# EAGLE design MainBoard (EAGLE 9.6.2)
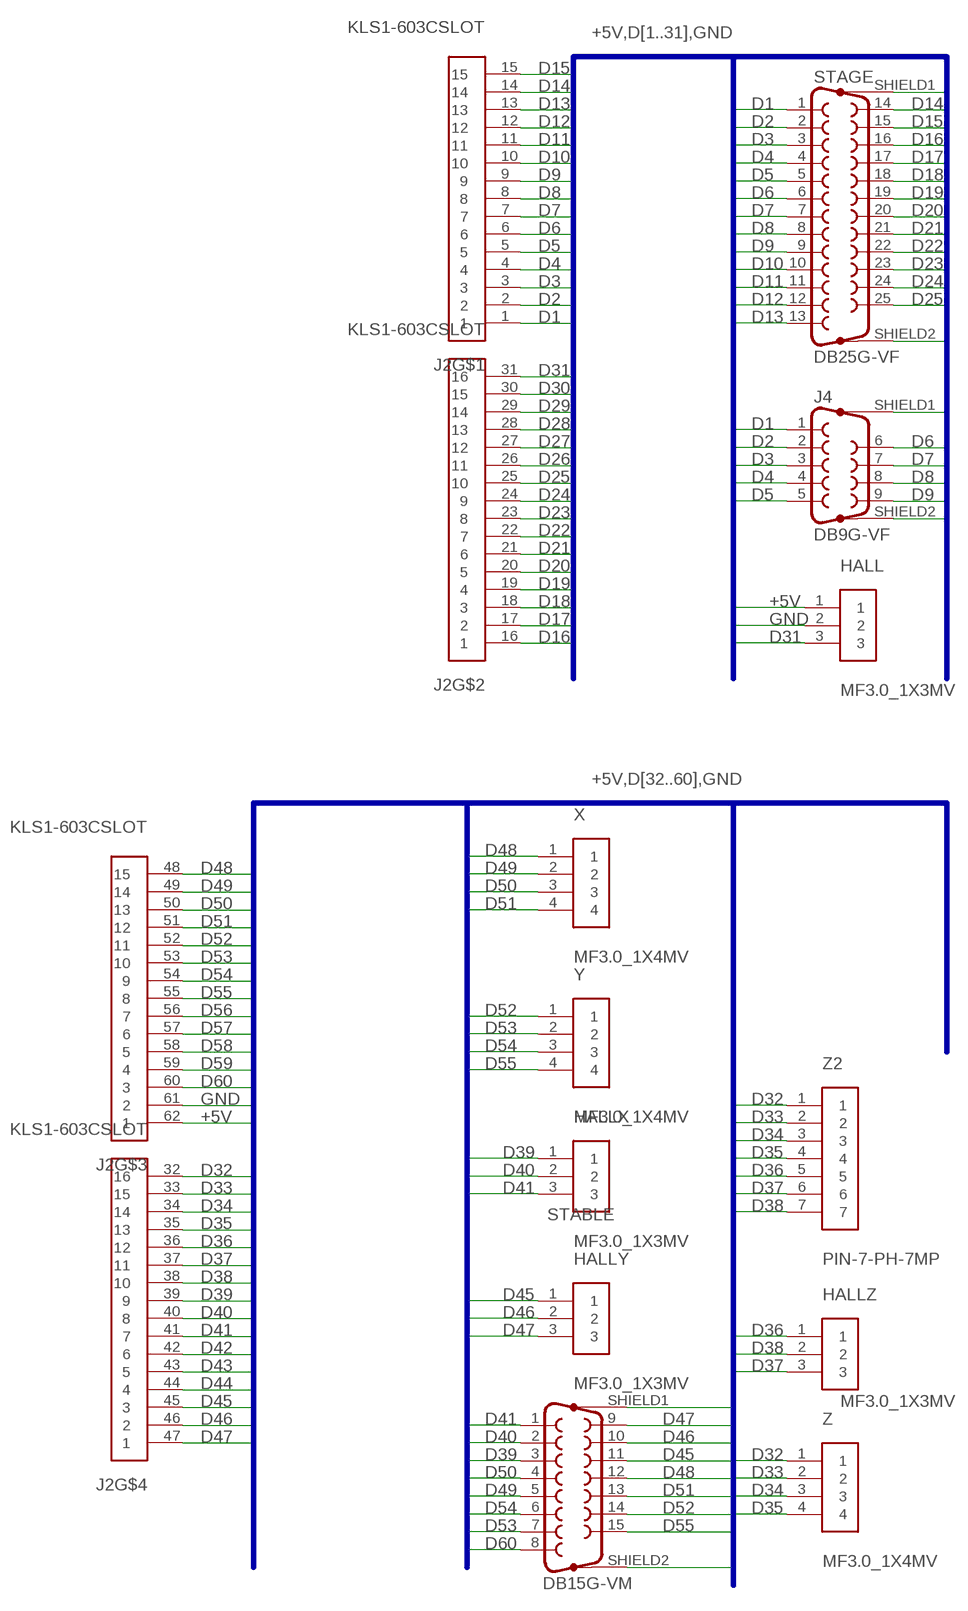
[diagram p0: schematic, sheet 1]

## Parts
HALL  MF3.0_1X3MV  [MF3.0_1X3MV]
HALLX  MF3.0_1X3MV  [MF3.0_1X3MV]
HALLY  MF3.0_1X3MV  [MF3.0_1X3MV]
HALLZ  MF3.0_1X3MV  [MF3.0_1X3MV]
J2  KLS1-603CSLOT  [KLS1-603C-SLOT]
J4  DB9G-VF  [DB9G-F]
STABLE  DB15G-VM  [DS1034-15]
STAGE  DB25G-VF  [DB25G-F]
X  MF3.0_1X4MV  [MF3.0_1X4MV]
Y  MF3.0_1X4MV  [MF3.0_1X4MV]
Z  MF3.0_1X4MV  [MF3.0_1X4MV]
Z2  PIN-7-PH-7MP  [PH-7MP]

## Nets
+5V: HALL.1 J2.62
D1: J2.1 J4.1 STAGE.1
D2: J2.2 J4.2 STAGE.2
D3: J2.3 J4.3 STAGE.3
D4: J2.4 J4.4 STAGE.4
D5: J2.5 J4.5 STAGE.5
D6: J2.6 J4.6 STAGE.6
D7: J2.7 J4.7 STAGE.7
D8: J2.8 J4.8 STAGE.8
D9: J2.9 J4.9 STAGE.9
D10: J2.10 STAGE.10
D11: J2.11 STAGE.11
D12: J2.12 STAGE.12
D13: J2.13 STAGE.13
D14: J2.14 STAGE.14
D15: J2.15 STAGE.15
D16: J2.16 STAGE.16
D17: J2.17 STAGE.17
D18: J2.18 STAGE.18
D19: J2.19 STAGE.19
D20: J2.20 STAGE.20
D21: J2.21 STAGE.21
D22: J2.22 STAGE.22
D23: J2.23 STAGE.23
D24: J2.24 STAGE.24
D25: J2.25 STAGE.25
D26: J2.26
D27: J2.27
D28: J2.28
D29: J2.29
D30: J2.30
D31: HALL.3 J2.31
D32: J2.32 Z2.1 Z.1
D33: J2.33 Z2.2 Z.2
D34: J2.34 Z2.3 Z.3
D35: J2.35 Z2.4 Z.4
D36: HALLZ.1 J2.36 Z2.5
D37: HALLZ.3 J2.37 Z2.6
D38: HALLZ.2 J2.38 Z2.7
D39: HALLX.1 J2.39 STABLE.3
D40: HALLX.2 J2.40 STABLE.2
D41: HALLX.3 J2.41 STABLE.1
D42: J2.42
D43: J2.43
D44: J2.44
D45: HALLY.1 J2.45 STABLE.11
D46: HALLY.2 J2.46 STABLE.10
D47: HALLY.3 J2.47 STABLE.9
D48: J2.48 STABLE.12 X.1
D49: J2.49 STABLE.5 X.2
D50: J2.50 STABLE.4 X.3
D51: J2.51 STABLE.13 X.4
D52: J2.52 STABLE.14 Y.1
D53: J2.53 STABLE.7 Y.2
D54: J2.54 STABLE.6 Y.3
D55: J2.55 STABLE.15 Y.4
D56: J2.56
D57: J2.57
D58: J2.58
D59: J2.59
D60: J2.60 STABLE.8
GND: HALL.2 J2.61 J4.SHIELD1(G1) J4.SHIELD2(G2) STABLE.SHIELD1(G1) STABLE.SHIELD2(G2) STAGE.SHIELD1(G1) STAGE.SHIELD2(G2)

## Buses
+5V,D[1..31],GND
+5V,D[32..60],GND

## Library data of the parts
HALL HALLX HALLY HALLZ = snx_con:MF3.0_1X3
J2 = snx_con:KLS1-603C
J4 = snx_con:DB9G
STABLE = snx_con:DB15G
STAGE = snx_con:DB25G
X Y Z = snx_con:MF3.0_1X4
Z2 = snx_con:PIN-7

## Board
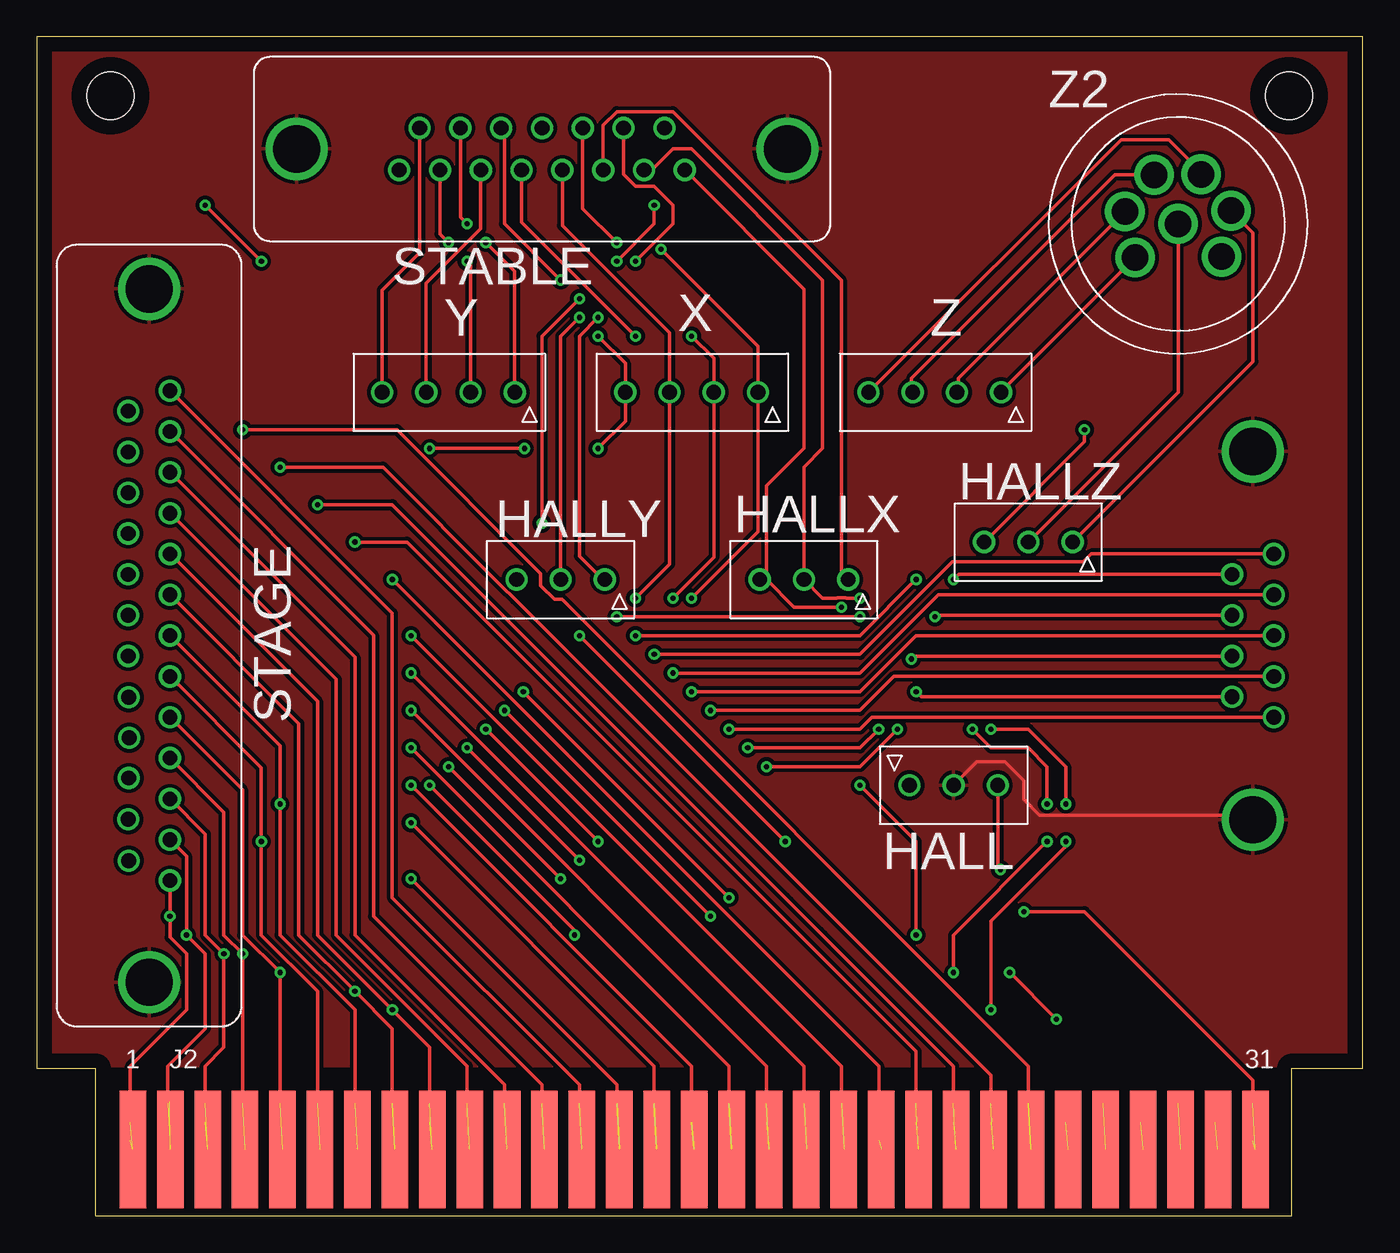
[diagram p1: board, top side]
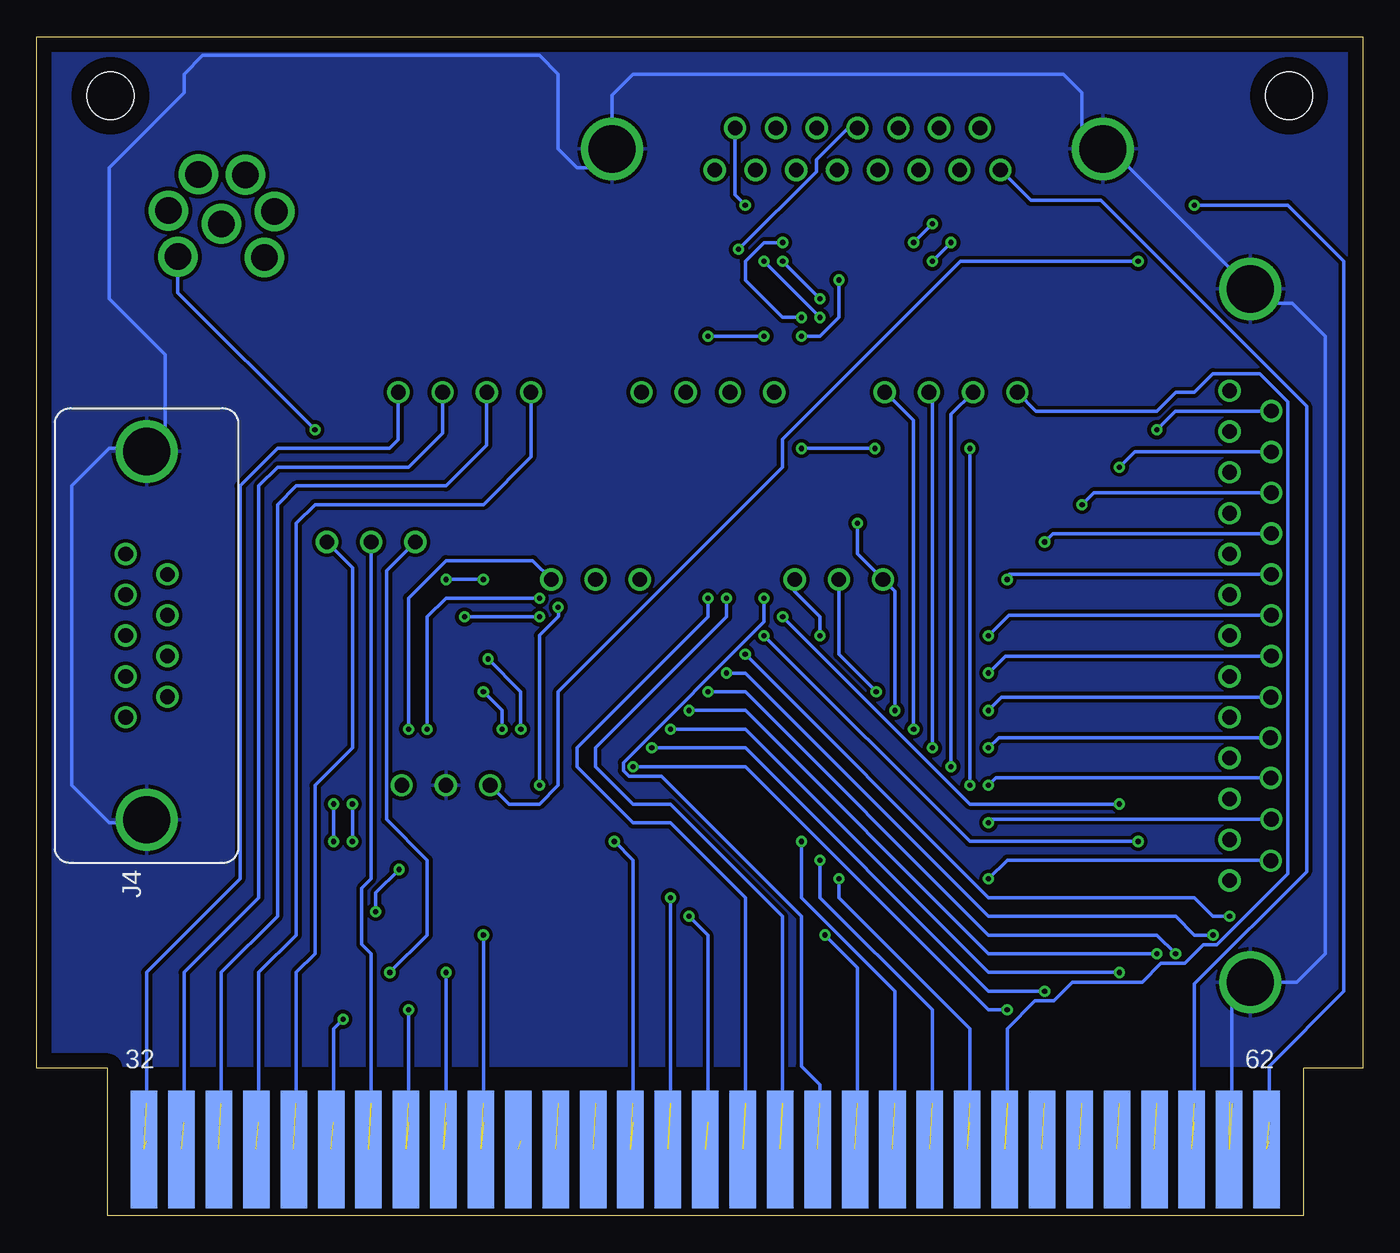
[diagram p2: board, bottom side, seen from below]

Size 90 x 80 mm. Coordinates in mm from the lower left corner, seen from the top.
Outline: 4,10 0,10 0,80 90,80 90,10 85.2,10
Copper layers (1*16): Top 0.035mm / dielectric 1.5mm / Bottom 0.035mm
Design rules "default": minimum track width 6mil, minimum drill 0.35mm, track to track 6mil, track to pad 6mil, pad to pad 6mil, via to via 6mil, smd to smd 6mil, copper to edge 40mil, drill to drill 6mil, minimum pad ring 10mil, minimum via ring 8mil, stop-mask expansion 4mil, vias tented up to drill 0mil, thermal gap 10mil
Holes 3.2 mm at 5,76 85,76

### Footprints (pad centres in the part's own frame; a part is rotated, then mirrored left to right if it is on the bottom)
MF3.0_1X3MV = drill 1: 1 3,0; 2 0,0; 3 -3,0
KLS1-603C-SLOT = smd 1.8 x 8: 1 2.52,4.5; 2 5.06,4.5; 3 7.6,4.5; 4 10.14,4.5; 5 12.68,4.5; 6 15.22,4.5; 7 17.76,4.5; 8 20.3,4.5; 9 22.84,4.5; 10 25.38,4.5; 11 27.92,4.5; 12 30.46,4.5; 13 33,4.5; 14 35.54,4.5; 15 38.08,4.5; 16 40.62,4.5; 17 43.16,4.5; 18 45.7,4.5; 19 48.24,4.5; 20 50.78,4.5; 21 53.32,4.5; 22 55.86,4.5; 23 58.4,4.5; 24 60.94,4.5; 25 63.48,4.5; 26 66.02,4.5; 27 68.56,4.5; 28 71.1,4.5; 29 73.64,4.5; 30 76.18,4.5; 31 78.72,4.5 | smd 1.8 x 8 bottom: 32 78.72,4.5; 33 76.18,4.5; 34 73.64,4.5; 35 71.1,4.5; 36 68.56,4.5; 37 66.02,4.5; 38 63.48,4.5; 39 60.94,4.5; 40 58.4,4.5; 41 55.86,4.5; 42 53.32,4.5; 43 50.78,4.5; 44 48.24,4.5; 45 45.7,4.5; 46 43.16,4.5; 47 40.62,4.5; 48 38.08,4.5; 49 35.54,4.5; 50 33,4.5; 51 30.46,4.5; 52 27.92,4.5; 53 25.38,4.5; 54 22.84,4.5; 55 20.3,4.5; 56 17.76,4.5; 57 15.22,4.5; 58 12.68,4.5; 59 10.14,4.5; 60 7.6,4.5; 61 5.06,4.5; 62 2.52,4.5
DB9G-F = drill 1: 1 5.54,1.42; 2 2.77,1.42; 3 0,1.42; 4 -2.77,1.42; 5 -5.54,1.42; 6 4.155,-1.42; 7 1.385,-1.42; 8 -1.385,-1.42; 9 -4.155,-1.42 | drill 3.2: SHIELD1 -12.495,0; SHIELD2 12.495,0
DS1034-15 = drill 1: 1 -9.695,1.42; 2 -6.925,1.42; 3 -4.155,1.42; 4 -1.385,1.42; 5 1.385,1.42; 6 4.155,1.42; 7 6.925,1.42; 8 9.695,1.42; 9 -8.31,-1.42; 10 -5.54,-1.42; 11 -2.77,-1.42; 12 0,-1.42; 13 2.77,-1.42; 14 5.54,-1.42; 15 8.31,-1.42 | drill 3.2: SHIELD1 -16.66,0; SHIELD2 16.66,0
DB25G-F = drill 1: 1 16.62,1.42; 2 13.85,1.42; 3 11.08,1.42; 4 8.31,1.42; 5 5.54,1.42; 6 2.77,1.42; 7 0,1.42; 8 -2.77,1.42; 9 -5.54,1.42; 10 -8.31,1.42; 11 -11.08,1.42; 12 -13.85,1.42; 13 -16.62,1.42; 14 15.27,-1.385; 15 12.465,-1.42; 16 9.66,-1.385; 17 6.925,-1.35; 18 4.19,-1.385; 19 1.385,-1.42; 20 -1.385,-1.42; 21 -4.155,-1.42; 22 -6.925,-1.42; 23 -9.695,-1.42; 24 -12.465,-1.42; 25 -15.235,-1.42 | drill 3.2: SHIELD1 -23.52,0; SHIELD2 23.52,0
MF3.0_1X4MV = drill 1: 1 4.5,0; 2 1.5,0; 3 -1.5,0; 4 -4.5,0
PH-7MP = drill 1.8: 1 3.7,0; 2 2.329,-2.877; 3 -0.77,-3.621; 4 -3.298,-1.682; 5 -3.383,1.503; 6 -0.96,3.574; 7 0,0

### Placement (x,y rotation side)
HALL  62.23,29.21 180 top
HALLX  52.07,43.18 0 top
HALLY  35.56,43.18 0 top
HALLZ  67.31,45.72 0 top
J2  4,0 0 top
J4  82.55,39.37 90 bottom
STABLE  34.29,72.39 180 top
STAGE  7.62,39.37 270 top
X  44.45,55.88 0 top
Y  27.94,55.88 0 top
Z  60.96,55.88 0 top
Z2  77.47,67.31 218 top

### Tracks (layer width: path | path; a pad name or v marks a point on that pad's centre or on a via)
+5V  (via drill 0.35)  (1 unrouted)
  Top 0.254: v15.24,64.77 v11.43,68.58
  Bottom 0.254: HALL.1 57.96,27.94 55.88,27.94 54.61,29.21 54.61,35.56 39.37,50.8 39.37,52.7 27.3,64.77 v15.24,64.77 | v11.43,68.58 5.08,68.58 1.27,64.77 1.27,15.24 6.35,10.16 6.35,6.35
D1  (via drill 0.35)  (1 unrouted)
  Top 0.254: STAGE.1 v9.04,20.32 9.04,18.9 10.16,17.78 10.16,13.97 6.35,10.16 6.35,5.08 | v41.91,38.1 55.88,38.1 62.15,44.37 71.06,44.37 71.6,44.91 J4.1
  Bottom 0.254: v41.91,38.1 25.4,21.59 11.43,21.59 10.16,20.32 v9.04,20.32
D2  (via drill 0.35)  (1 unrouted)
  Top 0.152: 8.89,7.62 9.01,7.74
  Top 0.254: STAGE.2 10.16,24.4 v10.16,19.05 11.43,17.78 11.43,12.7 8.89,10.16 8.89,7.62 | v43.18,36.83 55.88,36.83 61.19,42.14 J4.2
  Bottom 0.254: v43.18,36.83 41.91,36.83 25.4,20.32 12.7,20.32 11.43,19.05 v10.16,19.05
D3  (via drill 0.35)  (1 unrouted)
  Top 0.254: STAGE.3 11.43,25.9 11.43,19.05 v12.7,17.78 12.7,11.43 11.43,10.16 11.43,7.62 | v44.45,35.56 55.88,35.56 59.69,39.37 J4.3
  Bottom 0.254: v44.45,35.56 41.91,35.56 25.4,19.05 13.97,19.05 v12.7,17.78
D4  (via drill 0.35)  (1 unrouted)
  Top 0.254: STAGE.4 12.7,27.4 12.7,19.05 v13.97,17.78 13.97,7.62 | v45.72,34.29 55.88,34.29 58.19,36.6 J4.4
  Bottom 0.254: v45.72,34.29 41.91,34.29 25.4,17.78 v13.97,17.78
D5  (via drill 0.35)  (1 unrouted)
  Top 0.254: STAGE.5 13.97,28.9 13.97,19.05 v16.51,16.51 16.51,7.62 | v46.99,33.02 55.88,33.02 56.69,33.83 J4.5
  Bottom 0.254: v16.51,16.51 25.4,16.51 41.91,33.02 v46.99,33.02
D6  (via drill 0.35)  (1 unrouted)
  Top 0.254: STAGE.6 15.24,30.4 v15.24,25.4 15.24,19.05 19.05,15.24 19.05,7.62 | J4.6 62.58,43.52 v62.23,43.18 | v59.69,43.18 55.88,39.37 v40.64,39.37
  Bottom 0.254: v62.23,43.18 v59.69,43.18 | v40.64,39.37 26.67,25.4 v15.24,25.4
D7  (via drill 0.35)  (1 unrouted)
  Top 0.254: STAGE.7 16.51,31.9 v16.51,27.94 16.51,19.05 21.59,13.97 21.59,7.62 | J4.7 61.08,40.76 v60.96,40.64 | v55.88,40.64 v39.37,40.64
  Bottom 0.254: v60.96,40.64 v55.88,40.64 | v39.37,40.64 26.67,27.94 v16.51,27.94
D8  (via drill 0.35)  (1 unrouted)
  Top 0.254: STAGE.8 17.78,33.4 17.78,19.05 v21.59,15.24 24.13,12.7 24.13,7.62 | J4.8 59.58,37.98 v59.37,37.78 | v57.15,33.02 55.88,31.75 v48.26,31.75
  Bottom 0.254: v59.37,37.78 57.15,35.56 v57.15,33.02 | v48.26,31.75 41.91,31.75 25.4,15.24 v21.59,15.24
D9  (via drill 0.35)  (1 unrouted)
  Top 0.254: STAGE.9 19.05,34.9 19.05,19.05 v24.13,13.97 26.67,11.43 26.67,7.62 | J4.9 60.03,35.22 v59.69,35.56 | v49.53,30.48 55.88,30.48 v58.42,33.02
  Bottom 0.254: v59.69,35.56 58.42,34.29 v58.42,33.02 | v49.53,30.48 41.91,30.48 25.4,13.97 v24.13,13.97
D10  (1 unrouted)
  Top 0.254: STAGE.10 20.32,36.4 20.32,19.05 29.21,10.16 29.21,7.62
D11  (1 unrouted)
  Top 0.254: STAGE.11 21.59,37.9 21.59,19.05 31.75,8.89 31.75,7.62
D12  (1 unrouted)
  Top 0.254: STAGE.12 22.86,39.4 22.86,20.32 34.29,8.89 34.29,7.62
D13  (1 unrouted)
  Top 0.254: STAGE.13 24.13,40.9 24.13,21.59 36.83,8.89 36.83,7.62
D14  (via drill 0.35)  (1 unrouted)
  Top 0.254: 39.56,4.52 J2.14 | 39.37,7.62 39.37,8.89 v25.4,22.86
  Bottom 0.254: STAGE.14 6.26,24.13 24.13,24.13 v25.4,22.86
D15  (via drill 0.35)  (1 unrouted)
  Top 0.254: v25.4,26.67 41.91,10.16 41.91,7.62
  Bottom 0.254: STAGE.15 25.16,26.91 v25.4,26.67
D16  (via drill 0.35)  (1 unrouted)
  Top 0.254: v25.4,29.21 44.45,10.16 44.45,6.35
  Bottom 0.254: STAGE.16 24.9,29.71 v25.4,29.21
D17  (via drill 0.35)  (1 unrouted)
  Top 0.254: v25.4,31.75 46.99,10.16 46.99,7.62
  Bottom 0.254: STAGE.17 24.7,32.45 v25.4,31.75
D18  (via drill 0.35)  (1 unrouted)
  Top 0.254: v25.4,34.29 49.53,10.16 49.53,6.35
  Bottom 0.254: STAGE.18 24.51,35.18 v25.4,34.29
D19  (via drill 0.35)  (1 unrouted)
  Top 0.254: v25.4,36.83 52.07,10.16 52.07,7.62
  Bottom 0.254: STAGE.19 24.25,37.98 v25.4,36.83
D20  (via drill 0.35)  (1 unrouted)
  Top 0.254: v25.4,39.37 54.61,10.16 54.61,7.62
  Bottom 0.254: STAGE.20 24.02,40.76 v25.4,39.37
D21  (via drill 0.35)  (1 unrouted)
  Top 0.254: 57.15,5.08 57.15,10.16 v24.13,43.18
  Bottom 0.254: v24.13,43.18 24.13,43.38 23.98,43.52 STAGE.21
D22  (via drill 0.35)  (1 unrouted)
  Top 0.254: v21.59,45.72 25.13,45.72 59.69,11.16 59.69,6.35
  Bottom 0.254: STAGE.22 21.02,46.3 v21.59,45.72
D23  (via drill 0.35)  (1 unrouted)
  Top 0.254: v19.05,48.26 24.13,48.26 50.8,21.59 51.04,21.35 53.1,19.29 53.34,19.05 62.23,10.16 62.23,6.35
  Bottom 0.254: STAGE.23 18.25,49.06 v19.05,48.26
D24  (via drill 0.35)  (1 unrouted)
  Top 0.254: v16.51,50.8 23.5,50.8 31.53,42.77 31.53,42.75 32.45,41.83 32.47,41.83 64.77,9.53 64.77,6.35
  Bottom 0.254: STAGE.24 15.47,51.84 v16.51,50.8
D25  (via drill 0.35)  (1 unrouted)
  Top 0.254: v13.97,53.34 24.45,53.34 34.21,43.58 34.21,42.75 35.13,41.83 35.64,41.83 67.31,10.16 67.31,7.62
  Bottom 0.254: STAGE.25 12.71,54.6 v13.97,53.34
D31  (via drill 0.35)  (1 unrouted)
  Top 0.254: HALL.3 65.23,23.67 v65.41,23.5 | 82.55,5.08 82.55,9.21 71.12,20.64 v66.99,20.64
  Bottom 0.254: v65.41,23.5 66.99,21.91 v66.99,20.64
D32  (1 unrouted)
  Top 0.254: Z.1 65.46,55.94 Z2.1
  Bottom 0.254: Z.1 65.46,52.65 66.04,52.07 73.66,52.07 76.2,49.53 76.2,22.86 82.55,16.51 82.55,7.62
D33  (1 unrouted)
  Top 0.254: Z.2 62.55,55.97 62.55,56.83 Z2.2
  Bottom 0.254: Z.2 62.46,53.11 64.77,50.8 73.66,50.8 74.93,49.53 74.93,21.59 80.01,16.51 80.01,6.35
D34  (1 unrouted)
  Top 0.254: Z.3 59.37,55.97 59.37,56.83 73.18,70.64 Z2.3
  Bottom 0.254: Z.3 59.46,52.3 62.23,49.53 72.39,49.53 73.66,48.26 73.66,20.32 77.47,16.51 77.47,7.62
D35  (1 unrouted)
  Top 0.254: Z.4 73.61,73.03 76.83,73.03 79.03,70.83 Z2.4
  Bottom 0.254: Z.4 56.46,51.49 59.69,48.26 71.12,48.26 72.39,46.99 72.39,19.05 74.93,16.51 74.93,6.35
D36  (1 unrouted)
  Top 0.254: Z2.5 82.55,66.72 82.55,57.96 HALLZ.1
  Bottom 0.254: HALLZ.1 68.58,43.99 68.58,31.75 71.12,29.21 71.12,17.78 72.39,16.51 72.39,7.62
D37  (via drill 0.35)  (1 unrouted)
  Top 0.254: HALLZ.3 71.12,52.53 v71.12,53.34 | v66.04,16.51 v69.22,13.34
  Bottom 0.254: HALLZ.3 66.26,43.77 66.26,26.89 63.5,24.13 63.5,19.05 v66.04,16.51 | v69.22,13.34 69.85,12.7 69.85,6.35 | v71.12,53.34 80.43,62.65 Z2.6
D38  (1 unrouted)
  Top 0.254: Z2.7 77.47,55.88 HALLZ.2
  Bottom 0.254: HALLZ.2 67.31,22.86 67.94,22.23 67.94,18.41 67.31,17.78 67.31,7.62
D39  (via drill 0.35)  (1 unrouted)
  Top 0.254: STABLE.3 38.45,74 39.37,74.93 43.18,74.93 54.61,63.5 54.61,43.64 HALLX.1 | v64.77,33.02 67.31,33.02 69.85,30.48 v69.85,27.94 | v69.85,25.4 69.85,25.08 64.77,20 v64.77,13.97
  Bottom 0.254: v64.77,33.02 64.77,41.91 62.23,44.45 56.34,44.45 HALLX.1 | v69.85,27.94 v69.85,25.4 | v64.77,13.97 64.77,7.62
D40  (via drill 0.35)  (1 unrouted)
  Top 0.254: STABLE.2 41.76,70.97 43.18,72.39 44.45,72.39 53.34,63.5 53.34,52.07 52.07,50.8 HALLX.2 53.34,41.91 54.29,41.91 54.34,41.95 54.88,41.95 54.94,41.9 v55.88,41.9 | v63.5,33.02 64.77,31.75 67.31,31.75 68.58,30.48 v68.58,27.94 | v68.58,25.4 62.23,19.05 v62.23,16.51
  Bottom 0.254: v55.88,41.9 55.9,41.91 62.23,41.91 63.5,40.64 v63.5,33.02 | v68.58,27.94 v68.58,25.4 | v62.23,16.51 62.23,7.62
D41  (via drill 0.35)  (1 unrouted)
  Top 0.254: STABLE.1 52.07,62.88 52.07,52.07 49.53,49.53 49.53,43.18 | v59.69,19.05 59.69,25.4 v55.88,29.21 | HALLX.3 49.53,43.18 | v54.61,41.3 51.41,41.3 49.53,43.18
  Bottom 0.254: v54.61,41.3 54.61,40.98 54.59,41 54.59,40.69 55.88,39.39 v55.88,29.21 | v59.69,19.05 59.69,7.62
D45  (via drill 0.35)  (1 unrouted)
  Top 0.254: STABLE.11 37.06,68.35 v39.37,66.04 | v38.1,60.96 36.83,59.69 36.83,44.77 38.42,43.18 HALLY.1 | v36.83,39.37 v50.8,25.4
  Bottom 0.254: v39.37,66.04 40.64,66.04 41.91,64.77 41.91,63.5 39.37,60.96 v38.1,60.96 | HALLY.1 38.56,42.37 36.83,40.64 v36.83,39.37 | 49.53,7.62 49.53,24.13 v50.8,25.4
D46  (via drill 0.35)  (1 unrouted)
  Top 0.254: STABLE.10 39.83,70.66 40.64,69.85 41.91,69.85 43.18,68.58 43.18,67.31 v40.64,64.77 | v36.83,60.96 35.56,59.69 HALLY.2 | v33.02,35.56 v46.99,21.59
  Bottom 0.254: v40.64,64.77 v36.83,60.96 | HALLY.2 35.56,38.1 v33.02,35.56 | v46.99,21.59 46.99,7.62
D47  (via drill 0.35)  (1 unrouted)
  Top 0.254: v41.91,68.58 41.91,67.31 v39.37,64.77 | v36.83,62.23 34.29,59.69 v34.29,46.99 | v31.75,34.29 v45.72,20.32
  Bottom 0.254: STABLE.9 42.6,69.27 v41.91,68.58 | v39.37,64.77 v36.83,62.23 | v34.29,46.99 34.29,44.91 HALLY.3 31.75,42.37 v31.75,34.29 | v45.72,20.32 44.45,19.05 44.45,6.35
D48  (via drill 0.35)  (1 unrouted)
  Top 0.254: v42.38,65.58 48.95,59 X.1 48.95,46.41 v44.45,41.91
  Bottom 0.254: STABLE.12 34.92,73.81 36.73,72 36.74,72 37.09,71.65 37.09,70.86 v42.38,65.58 | v44.45,41.91 44.45,40.64 53.34,31.75 53.34,30.48 49.53,26.67 46.99,26.67 41.91,21.59 41.91,7.62
D49  (via drill 0.35)  (1 unrouted)
  Top 0.254: v40.64,59.69 32.91,67.42 STABLE.5 | v44.45,59.69 45.95,58.19 X.2 45.95,44.68 v43.18,41.91
  Bottom 0.254: v40.64,59.69 v44.45,59.69 | v43.18,41.91 43.18,40.64 52.07,31.75 52.07,30.48 49.53,27.94 46.99,27.94 39.37,20.32 39.37,7.62
D50  (via drill 0.35)  (1 unrouted)
  Top 0.254: STABLE.4 35.67,67.19 42.95,59.92 X.3 42.95,44.22 v40.64,41.91
  Bottom 0.254: v40.64,41.91 40.64,40.3 50.19,30.75 50.19,30.21 49.8,29.82 47.6,29.82 38.1,20.32 38.1,10.16 36.83,8.89 36.83,7.62
D51  (via drill 0.35)  (1 unrouted)
  Top 0.254: STABLE.13 31.75,73.58 31.75,67.31 v35.56,63.5 | v38.1,59.69 39.95,57.84 X.4 39.95,53.92 v38.1,52.07 | v33.1,52.07 v26.67,52.07 | v26.67,29.21 36.49,19.39 v36.49,19.05
  Bottom 0.254: v35.56,63.5 35.56,60.96 36.83,59.69 v38.1,59.69 | v38.1,52.07 v33.1,52.07 | v26.67,52.07 v26.67,29.21 | v36.49,19.05 36.49,19.03 34.29,16.83 34.29,7.62
D52  (via drill 0.35)  (1 unrouted)
  Top 0.254: STABLE.14 28.75,67.77 v29.21,67.31 | v30.48,66.04 32.44,64.08 Y.1 | v30.48,33.02 v38.1,25.4
  Bottom 0.254: v29.21,67.31 v30.48,66.04 | v38.1,25.4 38.1,21.59 31.75,15.24 31.75,7.62 | Y.1 32.38,55.88 30.48,53.98 v30.48,33.02
D53  (via drill 0.35)  (1 unrouted)
  Top 0.254: STABLE.7 27.36,66.61 v27.94,66.04 | v29.21,64.77 29.44,64.54 Y.2 | v29.21,31.75 v36.83,24.13
  Bottom 0.254: v27.94,66.04 v29.21,64.77 | Y.2 29.44,55.79 29.21,55.56 v29.21,31.75 | v36.83,24.13 36.83,21.59 29.21,13.97 29.21,7.62
D54  (via drill 0.35)  (1 unrouted)
  Top 0.254: STABLE.6 30.14,66.97 26.44,63.27 Y.3 | v27.94,30.48 v35.56,22.86
  Bottom 0.254: v35.56,22.86 35.56,21.59 26.67,12.7 26.67,6.35 | Y.3 27.94,54.38 v27.94,30.48
D55  (1 unrouted)
  Top 0.254: STABLE.15 25.98,65.35 23.44,62.81 Y.4
  Bottom 0.254: Y.4 22.17,54.61 13.97,54.61 12.7,55.88 11.43,55.88 10.16,57.15 6.99,57.15 5.08,55.24 5.08,23.2 9.89,18.39 10.82,18.39 12.09,17.12 13.7,17.12 14.97,15.85 19.71,15.85 20.98,14.58 22.25,14.58 24.13,12.7 24.13,7.62
D60  (1 unrouted)
  Bottom 0.254: STABLE.8 22.52,68.9 17.78,68.9 3.81,54.93 3.81,23.35 11.43,15.73 11.43,6.35
GND  (1 unrouted)
  Top 0.254: J4.SHIELD1 82.23,27.19 68.06,27.19 66.99,28.26 66.99,29.53 65.72,30.8 63.82,30.8 HALL.2
  Bottom 0.254: J4.SHIELD1 82.75,26.67 85.09,26.67 87.63,29.21 87.63,49.53 85.09,52.07 82.55,52.07 81.28,53.34 81.28,58.42 85.09,62.23 85.09,71.12 80.01,76.2 80.01,77.47 78.74,78.74 55.88,78.74 54.61,77.47 54.61,72.39 53.34,71.12 52.22,71.12 STABLE.SHIELD1 50.95,76.05 49.53,77.47 20.32,77.47 19.05,76.2 19.05,73.81 STABLE.SHIELD2 17.12,72.39 STAGE.SHIELD1 6.66,61.92 4.78,61.92 2.54,59.69 2.54,17.78 4.47,15.85 STAGE.SHIELD2 8.89,14.58 8.89,7.62
  pour Top (isolate 0.254): -2.54,81.28 -2.54,10.16 92.71,10.16 92.71,81.28
  pour Bottom (isolate 0.254): -2.54,81.28 -2.54,10.16 92.71,10.16 92.71,81.28